# Altium schematic sheet Part M.SchDoc
size A4; SheetNumber: 8; SheetTotal: 16
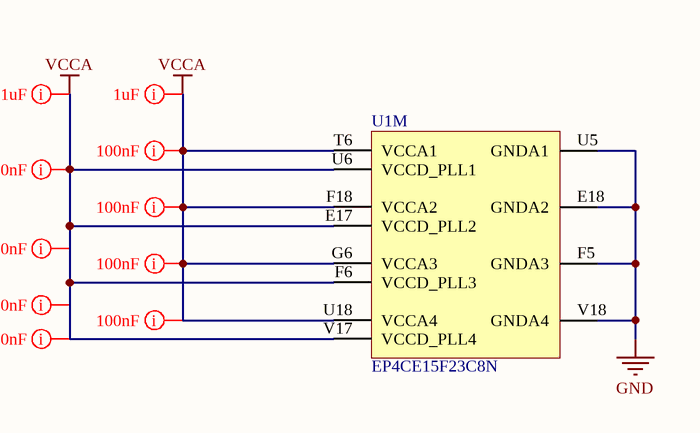
[diagram p0: Part M.SchDoc]

## Parts
U1  EP4CE15F23C8N  [FBGA484_A-240]  (part M of 13)

## Nets
GND: U1.E18(GNDA2) U1.F5(GNDA3) U1.U5(GNDA1) U1.V18(GNDA4)
VCCA: U1.E17(VCCD_PLL2) U1.F6(VCCD_PLL3) U1.F18(VCCA2) U1.G6(VCCA3) U1.T6(VCCA1) U1.U6(VCCD_PLL1) U1.U18(VCCA4) U1.V17(VCCD_PLL4)

## Layout directives
mark named 1uF: VCCA
mark named 100nF: VCCA

## Library data of the parts
U1 = FPGA_EP4CE15F23C8N: Cyclone IV Family FPGA, 1.2V Core, 343 I/O Pins, 4 PLLs, 484-Pin FBGA, Speed Grade 8, Commercial Grade, Pb-Free; Manufacturer: Altera; PackageVersion: ver1.0, Jun-2011; PackageReference: FBGA484_A-240; ComponentLink3URL: http://www.altera.com/literature/lit-dp.jsp?category=cyc%204&showspreadsheet=y; ComponentLink1Description: Manufacturer URL; DatasheetVersion: ver1.6, Nov-2011; ComponentLink3Description: Pinout; ComponentLink2URL: http://www.altera.com/literature/hb/cyclone-iv/cyclone4-handbook.pdf; ComponentLink1URL: http://www.altera.com/; ComponentLink2Description: Handbook; PackageDescription: 484-Pin FineLine Ball Grid Array (FBGA) - Wire Bond - A:2.40; Code_JEDEC: MS-034-AAJ-1; ComponentLink4URL: http://www.altera.com/devicepackaging/04R00247-02.pdf; ComponentLink4Description: Package Specification